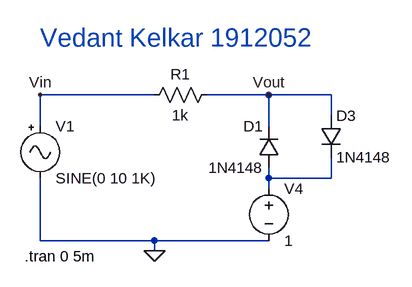
[diagram p0: schematic Draft18.asc]
Draft18.asc, the LTspice schematic file:
Version 4
SHEET 1 880 680
WIRE 80 -80 -96 -80
WIRE 256 -80 160 -80
WIRE 352 -80 256 -80
WIRE 352 -48 352 -80
WIRE -96 -32 -96 -80
WIRE 256 -32 256 -80
WIRE 256 48 256 32
WIRE 352 48 352 16
WIRE 352 48 256 48
WIRE 256 64 256 48
WIRE -96 144 -96 48
WIRE 80 144 -96 144
WIRE 256 144 80 144
WIRE 80 160 80 144
FLAG 80 160 0
FLAG -96 -80 Vin
FLAG 256 -80 Vout
SYMBOL diode 272 32 R180
WINDOW 0 24 64 Left 2
WINDOW 3 24 0 Left 2
SYMATTR InstName D1
SYMATTR Value 1N4148
SYMBOL res 176 -96 R90
WINDOW 0 0 56 VBottom 2
WINDOW 3 32 56 VTop 2
SYMATTR InstName R1
SYMATTR Value 1k
SYMBOL Misc\\signal -96 -48 R0
WINDOW 123 0 0 Left 0
WINDOW 39 0 0 Left 0
SYMATTR InstName V1
SYMATTR Value SINE(0 10 1K)
SYMBOL diode 336 -48 R0
SYMATTR InstName D3
SYMATTR Value 1N4148
SYMBOL voltage 256 48 R0
WINDOW 123 0 0 Left 0
WINDOW 39 0 0 Left 0
SYMATTR InstName V4
SYMATTR Value 1
TEXT -120 168 Left 2 !.tran 0 5m
TEXT -96 -168 Left 4 ;Vedant Kelkar 1912052

The netlist it stands for:
* Draft18.asc
D1 N001 Vout 1N4148
R1 Vout Vin 1k
V1 Vin 0 SINE(0 10 1K)
D3 Vout N001 1N4148
V4 N001 0 1
.model D D
.lib standard.dio
.tran 0 5m
* Vedant Kelkar 1912052
.backanno
.end